# EAGLE design buttons (EAGLE 5.10)
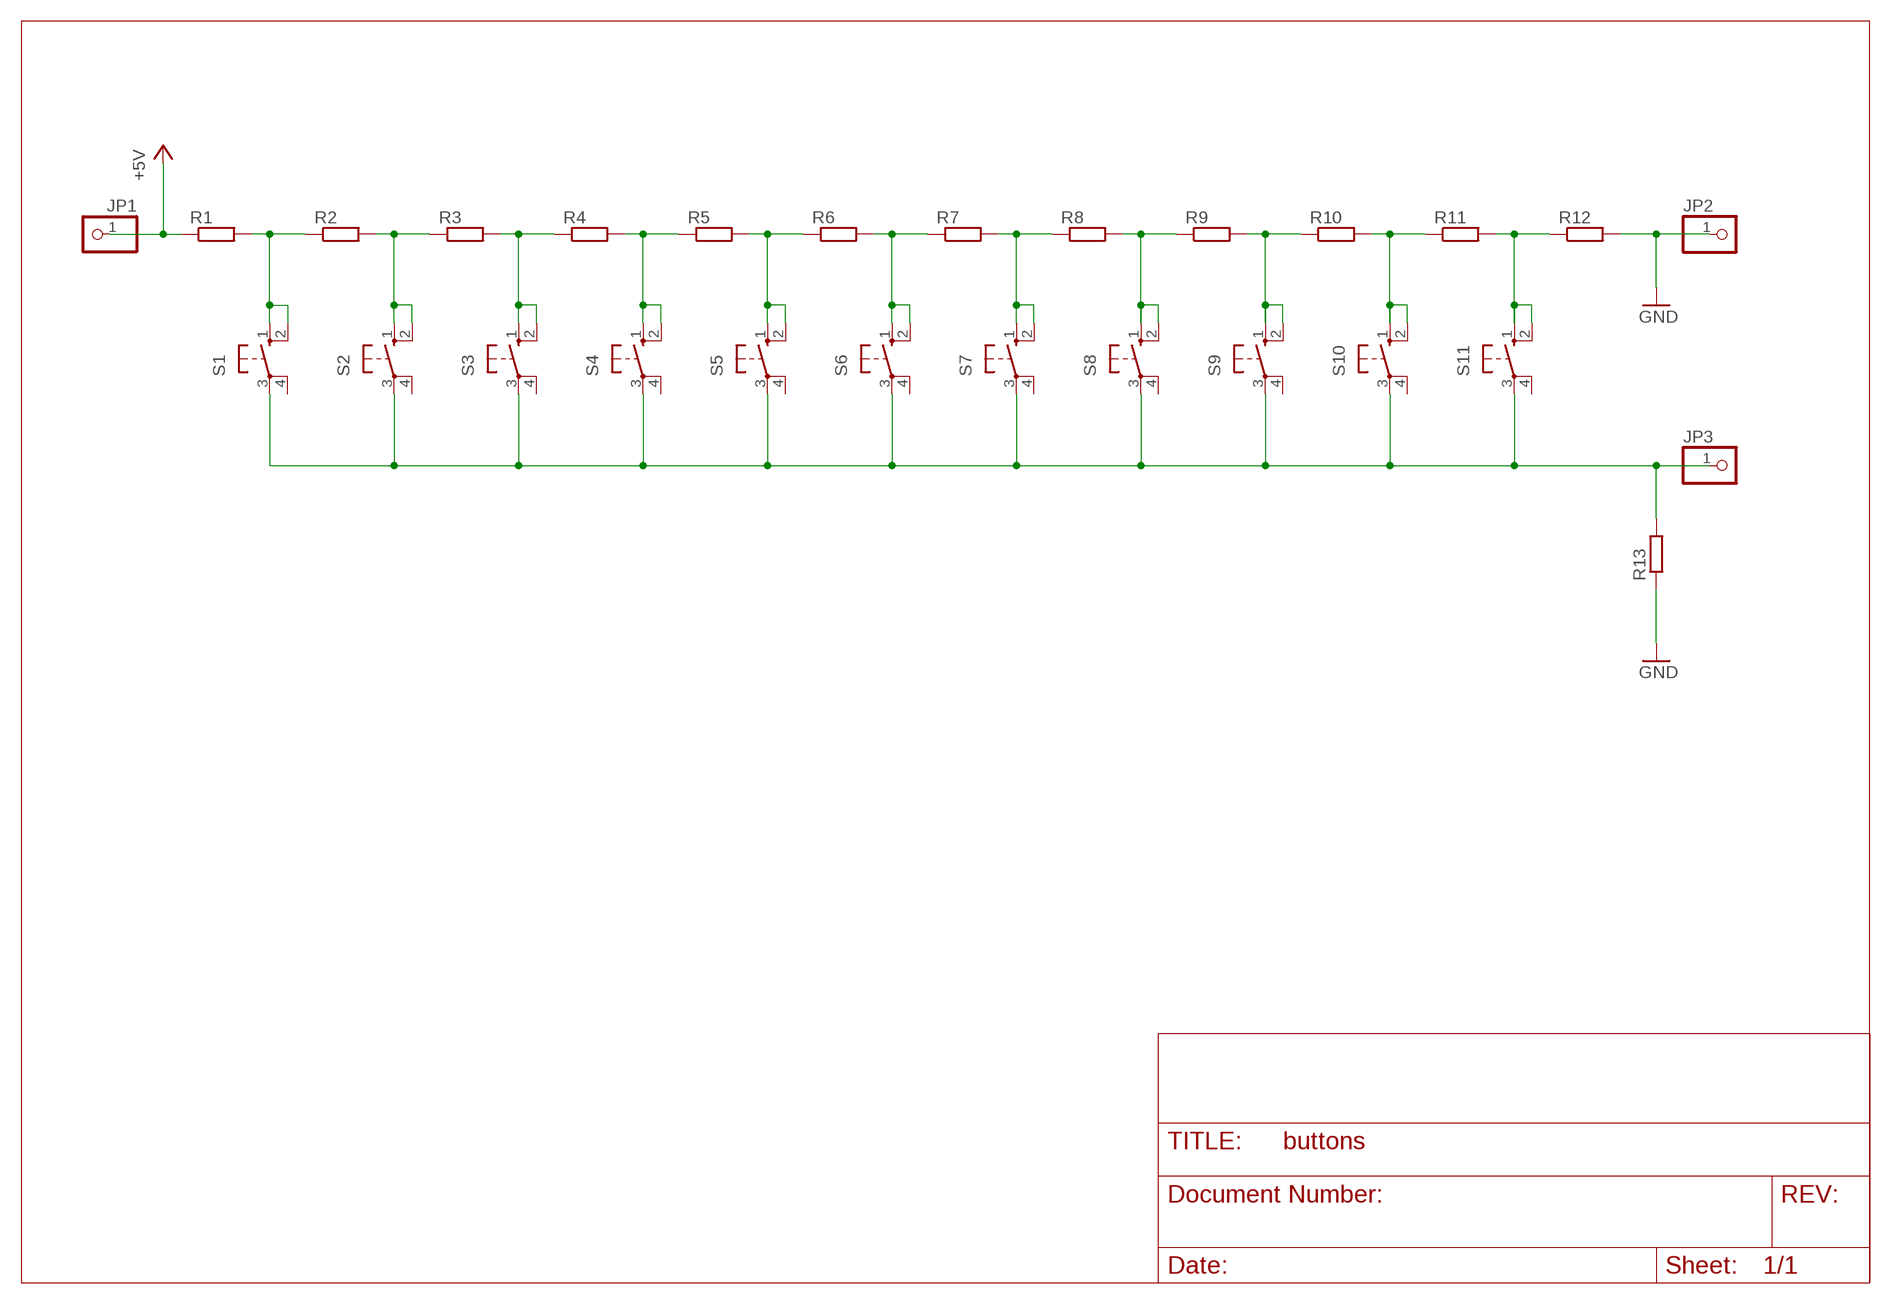
[diagram p0: schematic, sheet 1]

## Parts
JP1  PINHD-1X1  [1X01]
JP2  PINHD-1X1  [1X01]
JP3  PINHD-1X1  [1X01]
R1  R-EU_M1206  [M1206]
R2  R-EU_M1206  [M1206]
R3  R-EU_M1206  [M1206]
R4  R-EU_M1206  [M1206]
R5  R-EU_M1206  [M1206]
R6  R-EU_M1206  [M1206]
R7  R-EU_M1206  [M1206]
R8  R-EU_M1206  [M1206]
R9  R-EU_M1206  [M1206]
R10  R-EU_M1206  [M1206]
R11  R-EU_M1206  [M1206]
R12  R-EU_M1206  [M1206]
R13  R-EU_M1206  [M1206]
S1  10-XX  [B3F-10XX]
S2  10-XX  [B3F-10XX]
S3  10-XX  [B3F-10XX]
S4  10-XX  [B3F-10XX]
S5  10-XX  [B3F-10XX]
S6  10-XX  [B3F-10XX]
S7  10-XX  [B3F-10XX]
S8  10-XX  [B3F-10XX]
S9  10-XX  [B3F-10XX]
S10  10-XX  [B3F-10XX]
S11  10-XX  [B3F-10XX]

## Nets
+5V: JP1.1 R1.1
GND: JP2.1 R12.2 R13.1
N$2: R1.2 R2.1 S1.1(S) S1.2(S1)
N$3: R2.2 R3.1 S2.1(S) S2.2(S1)
N$4: R3.2 R4.1 S3.1(S) S3.2(S1)
N$5: R4.2 R5.1 S4.1(S) S4.2(S1)
N$6: R5.2 R6.1 S5.1(S) S5.2(S1)
N$7: R6.2 R7.1 S6.1(S) S6.2(S1)
N$8: R7.2 R8.1 S7.1(S) S7.2(S1)
N$9: R8.2 R9.1 S8.1(S) S8.2(S1)
N$10: R9.2 R10.1 S9.1(S) S9.2(S1)
N$11: R10.2 R11.1 S10.1(S) S10.2(S1)
N$12: R11.2 R12.1 S11.1(S) S11.2(S1)
N$13: JP3.1 R13.2 S1.3(P) S2.3(P) S3.3(P) S4.3(P) S5.3(P) S6.3(P) S7.3(P) S8.3(P) S9.3(P) S10.3(P) S11.3(P)
Unconnected: S1.4(P1) S2.4(P1) S3.4(P1) S4.4(P1) S5.4(P1) S6.4(P1) S7.4(P1) S8.4(P1) S9.4(P1) S10.4(P1) S11.4(P1)

## Library data of the parts
JP1-JP3 = pinhead:PINHD-1X1: PIN HEADER
R1-R13 = rcl:R-EU_: RESISTOR, European symbol
S1-S11 = switch-omron:10-XX: OMRON SWITCH

## Board
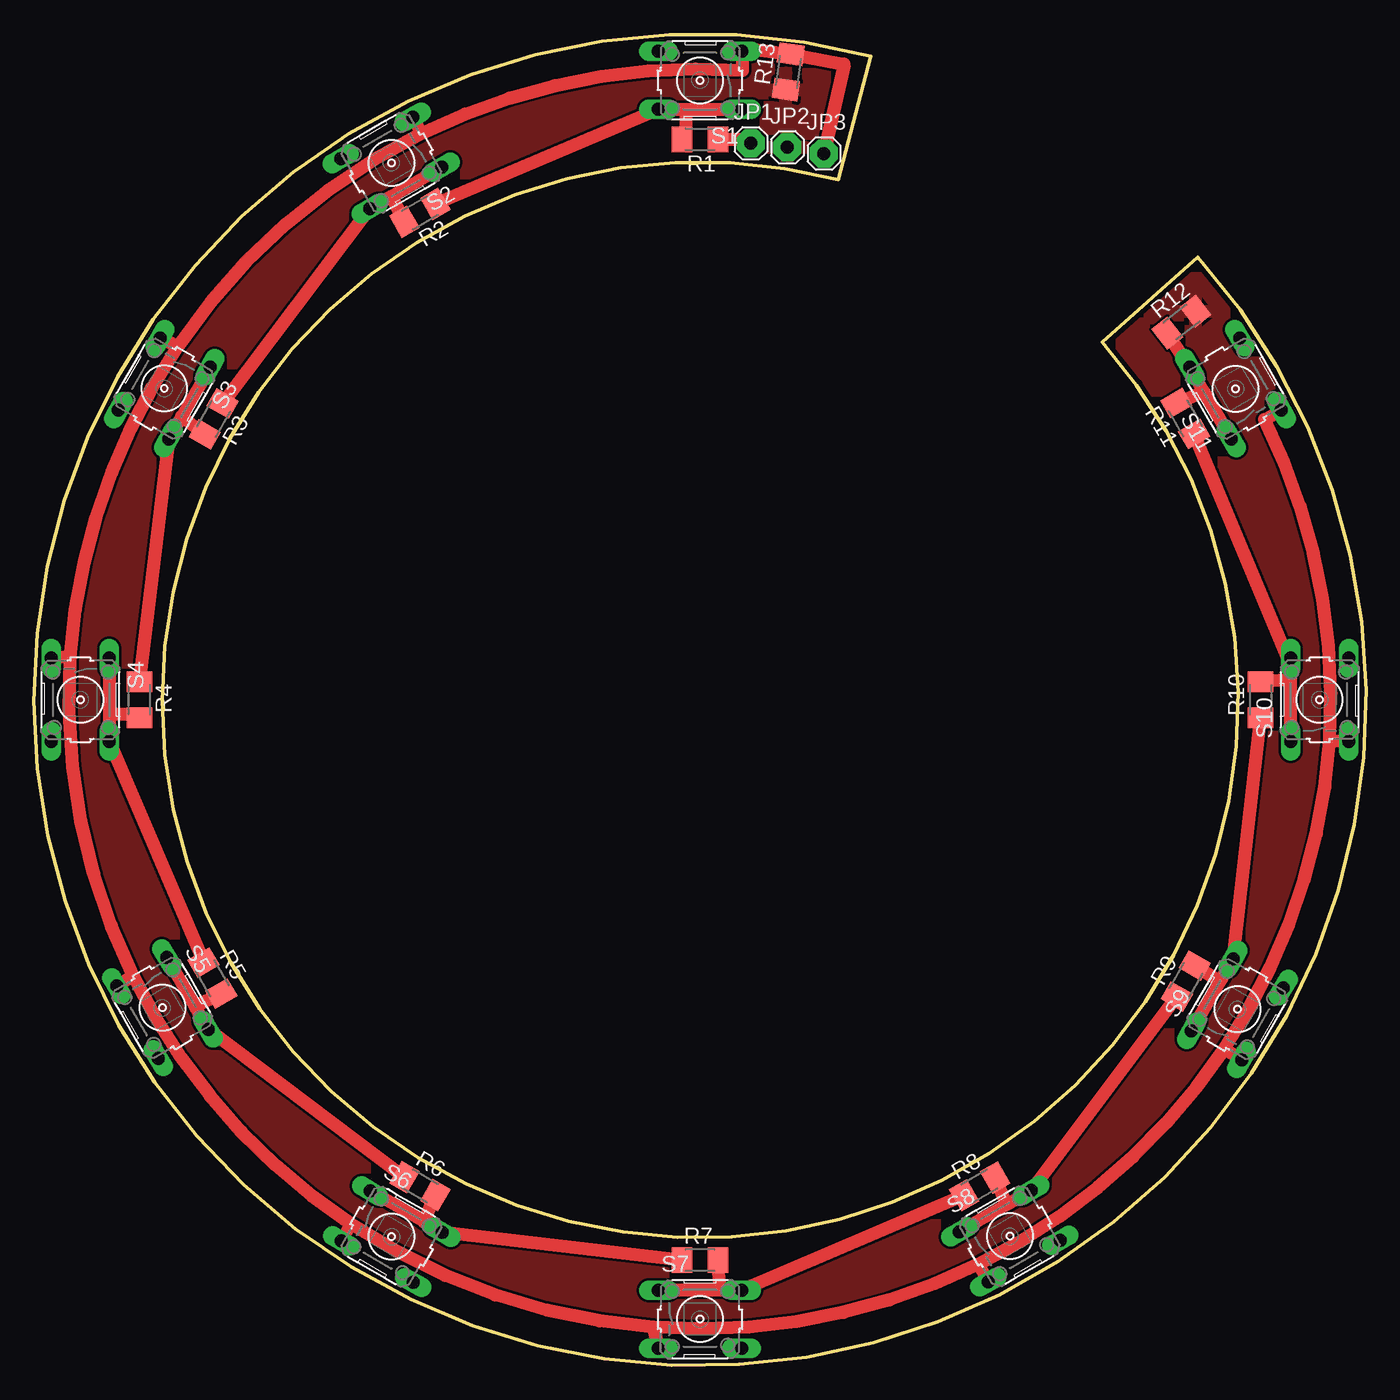
[diagram p1: board, top side]

Size 104.11 x 104.02 mm. Coordinates in mm from the lower left corner, seen from the top.
Outline: 65.39,102.34 62.85,92.65 arc327 83.49,79.95 90.95,86.62 arc-327 65.39,102.34
Copper layers (1*16): Top 0.035mm / dielectric 1.5mm / Bottom 0.035mm
Design rules "default *": minimum track width 10mil, minimum drill 24mil, track to track 8mil, track to pad 8mil, pad to pad 8mil, via to via 8mil, smd to smd 8mil, copper to edge 15mil, drill to drill 8mil, minimum pad ring 10mil, minimum via ring 8mil, stop-mask expansion 4mil, vias tented up to drill 0mil, thermal gap 10mil

### Footprints (pad centres in the part's own frame; a part is rotated, then mirrored left to right if it is on the bottom)
1X01 = drill 1.016 pad 2.184 octagon: 1 0,0
M1206 = smd 1.6 x 2: 1 -1.4,0; 2 1.4,0
B3F-10XX = drill 1.016 long: 1 -3.251,2.261; 2 3.251,2.261; 3 -3.251,-2.261; 4 3.251,-2.261

### Placement (x,y rotation side)
JP1  56.03,95.51 0 top
JP2  58.88,95.19 0 top
JP3  61.74,94.72 0 top
R1  52.06,95.83 180 top
R2  30.17,90.08 210 top
R3  14.05,73.96 240 top
R4  8.24,52.01 270 top
R5  13.96,30.26 300 top
R6  30.17,13.99 330 top
R7  52.06,8.2 0 top
R8  73.91,13.97 30 top
R9  90.02,30.03 60 top
R10  95.87,52.01 90 top
R11  89.98,74 120 top
R12  89.68,81.53 38 top
R13  58.96,101.1 82 top
S1  52.06,100.43 180 top
S2  27.93,93.99 210 top
S3  10.19,76.34 240 top
S4  3.64,52.01 270 top
S5  10.05,27.94 300 top
S6  27.95,10.04 330 top
S7  52.06,3.59 0 top
S8  76.27,10.08 30 top
S9  94.05,27.82 60 top
S10  100.48,52.01 90 top
S11  93.91,76.33 120 top

### Tracks (layer width: path | path; a pad name or v marks a point on that pad's centre or on a via)
+5V
  Top 1.016: R1.1 56.03,95.83 JP1.1
GND
  pour Top: -3.35,-1.65 106.03,-1.96 108.41,105.35 -0.81,105.67
N$2
  Top 1: R2.1 S1.2
  Top 1.016: S1.2 50.95,98.17 | 50.95,98.17 S1.1 | R1.2 50.95,95.83 50.95,98.17
N$3
  Top 1: 27.91,91.36 S2.2 R3.1 | 27.91,91.36 S2.1 | 27.91,91.36 R2.2
N$4
  Top 1: S3.1 11.54,74.17 | 11.54,74.17 S3.2 R4.1 | 11.54,74.17 R3.2
N$5
  Top 1: S4.2 R5.1
  Top 1.016: S4.1 5.9,50.9 | 5.9,50.9 S4.2 | R4.2 7.95,50.9 5.9,50.9
N$6
  Top 1: S5.1 12.59,28.05 | 12.59,28.05 S5.2 R6.1 | 12.59,28.05 R5.2
N$7
  Top 1: 30.5,11.19 S6.2 R7.1 | 30.5,11.19 S6.1 | 30.5,11.19 R6.2
N$8
  Top 1: 53.64,5.85 S7.2 R8.1 | 53.64,5.85 S7.1 | 53.64,5.85 R7.2
N$9
  Top 1: 76.02,12.55 S8.2 R9.1 | 76.02,12.55 S8.1 | 76.02,12.55 R8.2
N$10
  Top 1: S9.1 S9.2 | R9.2 92.67,29.96 S9.2 | S9.2 R10.1
N$11
  Top 1: S10.1 98.22,53.6 | 98.22,53.6 98.22,54.71 | 98.22,54.71 S10.2 | 98.22,53.6 R10.2 | 98.22,54.71 R11.1
N$12
  Top 1: 91.43,76.1 S11.1 | 91.43,76.1 S11.2 R12.1 | R11.2 91.43,76.1
N$13
  Top 1: JP3.1 63.33,101.7 60,102.34 59.16,102.5 R13.2 56.27,102.85 S1.3 55.39,102.69 55.39,101.22 arc30 30.31,96.3 | 11.26,79.63 arc-30 30.31,96.3 | 30.31,96.3 S2.3 | 7.77,30.42 arc-30 2.85,55.35 | 2.85,55.35 arc-30 11.26,79.63 | 2.85,55.35 S4.3 | 11.26,79.63 S3.3 | 24.75,11.05 arc-30 7.77,30.42 | 48.41,2.96 arc-29 24.75,11.05 | 7.77,30.42 S5.3 | 24.75,11.05 S6.3 | 48.41,2.96 S7.3 | 73.81,7.88 arc-30 48.41,2.96 | 73.81,7.88 S8.3 | 93.02,24.71 arc-30 73.81,7.88 | 93.02,24.71 arc30 101.27,48.84 | 101.27,48.84 arc30 96.19,73.92 S11.3 | 101.27,48.84 S10.3 | S9.3 93.02,24.71